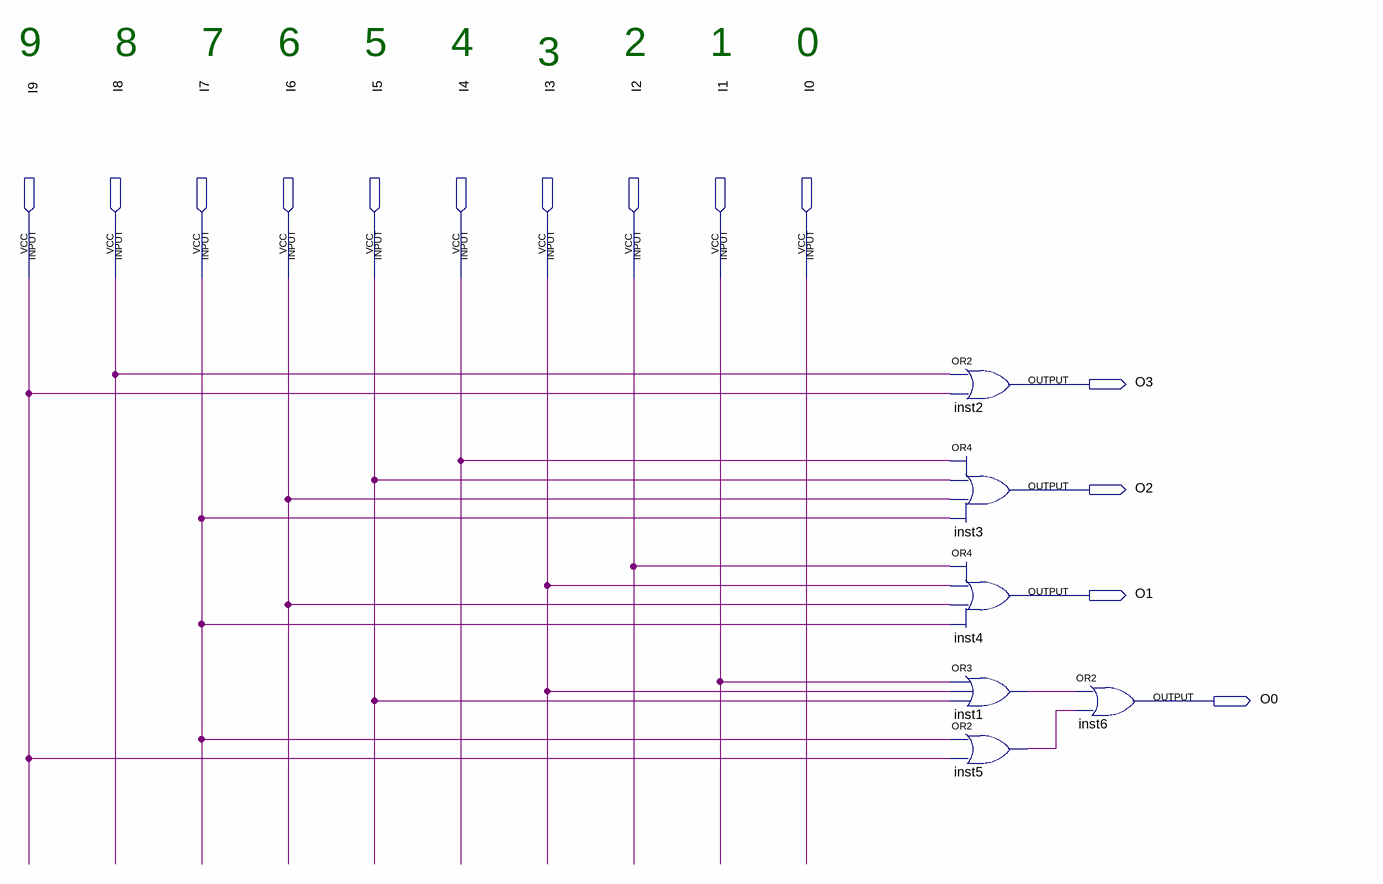
[diagram p0: schematic sheet]
// Quartus schematic kim_BCD_decorder.bdf as structural Verilog: 6 symbols, 14 pins
module kim_BCD_decorder (
  input  I9,
  input  I8,
  input  I7,
  input  I6,
  input  I5,
  input  I4,
  input  I3,
  input  I2,
  input  I1,
  input  I0,
  output O3,
  output O2,
  output O1,
  output O0
);

  wire inst1_out, inst5_out;

  or inst2 (O3, I8, I9);
  or inst3 (O2, I4, I5, I6, I7);
  or inst4 (O1, I2, I3, I6, I7);
  or inst1 (inst1_out, I1, I3, I5);
  or inst5 (inst5_out, I7, I9);
  or inst6 (O0, inst1_out, inst5_out);

  // Notes on the sheet:
  //   9
  //   8
  //   7
  //   6
  //   5
  //   4
  //   2
  //   1
  //   0
  //   3
endmodule
